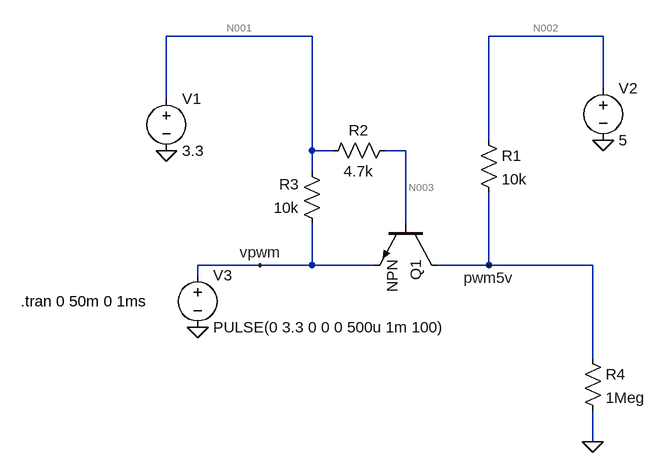
[diagram p0: schematic convertidor3_3_to_5.asc]
convertidor3_3_to_5.asc, the LTspice schematic file:
Version 4
SHEET 1 1016 680
WIRE 0 -112 -224 -112
WIRE 448 -112 272 -112
WIRE 448 -32 448 -112
WIRE -224 -16 -224 -112
WIRE 272 48 272 -112
WIRE 0 64 0 -112
WIRE 32 64 0 64
WIRE 144 64 112 64
WIRE 0 96 0 64
WIRE 144 176 144 64
WIRE -80 240 -176 240
WIRE 0 240 0 176
WIRE 0 240 -80 240
WIRE 96 240 0 240
WIRE 272 240 272 128
WIRE 272 240 192 240
WIRE 432 240 272 240
WIRE -176 256 -176 240
WIRE 432 384 432 240
WIRE 432 512 432 464
FLAG -224 64 0
FLAG 448 48 0
FLAG -176 336 0
FLAG -80 240 vpwm
FLAG 272 240 pwm5v
FLAG 432 512 0
SYMBOL res 256 32 R0
SYMATTR InstName R1
SYMATTR Value 10k
SYMBOL res 128 48 R90
WINDOW 0 0 56 VBottom 2
WINDOW 3 32 56 VTop 2
SYMATTR InstName R2
SYMATTR Value 4.7k
SYMBOL res 16 192 R180
WINDOW 0 36 76 Left 2
WINDOW 3 36 40 Left 2
SYMATTR InstName R3
SYMATTR Value 10k
SYMBOL npn 192 176 R90
SYMATTR InstName Q1
SYMBOL voltage -224 -32 R0
WINDOW 123 0 0 Left 0
WINDOW 39 0 0 Left 0
SYMATTR InstName V1
SYMATTR Value 3.3
SYMBOL voltage 448 -48 R0
WINDOW 123 0 0 Left 0
WINDOW 39 0 0 Left 0
SYMATTR InstName V2
SYMATTR Value 5
SYMBOL voltage -176 240 R0
WINDOW 123 0 0 Left 0
WINDOW 39 0 0 Left 0
SYMATTR InstName V3
SYMATTR Value PULSE(0 3.3 0 0 0 500u 1m 100)
SYMBOL res 416 368 R0
SYMATTR InstName R4
SYMATTR Value 1Meg
TEXT -448 296 Left 2 !.tran 0 50m 0 1ms

The netlist it stands for:
* convertidor3_3_to_5.asc
R1 N002 pwm5v 10k
R2 N003 N001 4.7k
R3 vpwm N001 10k
Q1 pwm5v N003 vpwm 0 NPN
V1 N001 0 3.3
V2 N002 0 5
V3 vpwm 0 PULSE(0 3.3 0 0 0 500u 1m 100)
R4 pwm5v 0 1Meg
.model NPN NPN
.model PNP PNP
.lib standard.bjt
.tran 0 50m 0 1ms
.backanno
.end

* Results of the author's LTspice run, read from the files saved beside the schematic
* Operating Point, zero values left out:
*   V(n002) = 5 V
*   V(pwm5v) = 28.04 mV
*   V(n003) = 785.3 mV
*   V(n001) = 3.3 V
*   Ic(Q1) = 497.2 µA
*   Ib(Q1) = 535 µA
*   Ie(Q1) = -1.032 mA
*   I(R1) = 497.2 µA
*   I(R2) = -535 µA
*   I(R3) = -330 µA
*   I(R4) = 28.04 nA
*   I(V1) = -865 µA
*   I(V2) = -497.2 µA
*   I(V3) = 1.362 mA
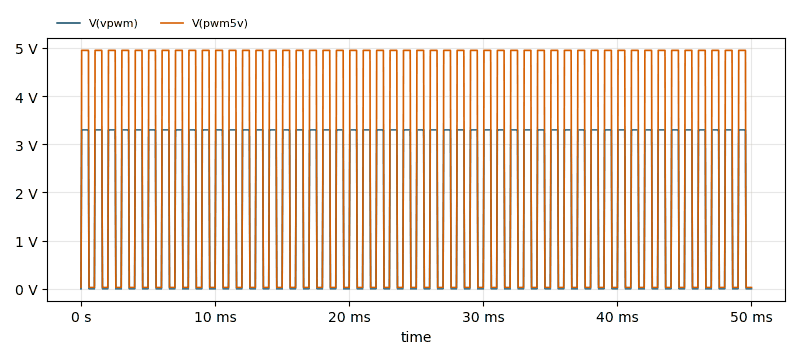
[diagram p1: Transient Analysis of convertidor3_3_to_5.asc, plotted from the saved traces]
* Transient Analysis, 1 run:
*   V(vpwm): min 0 V, max 3.3 V, average 1.815 V, rms 2.414 V, last 0 V
*   V(pwm5v): min 28.04 mV, max 4.95 V, average 2.692 V, rms 3.595 V, last 28.04 mV